# Altium schematic sheet lcd.SchDoc
size A4
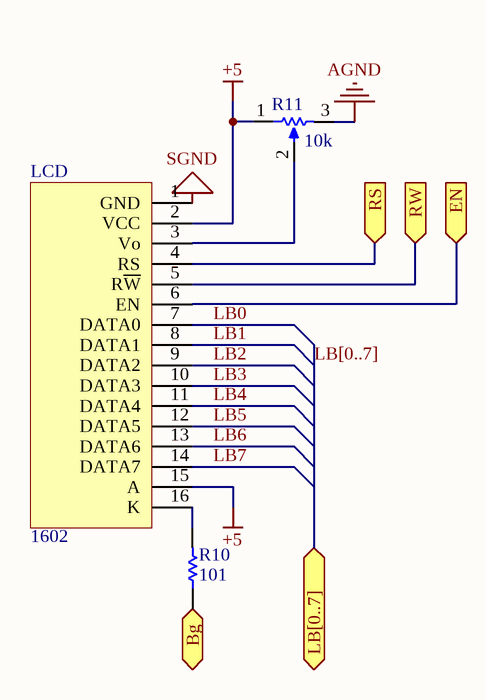
[diagram p0: lcd.SchDoc]

## Parts
LCD  1602  [1602(DIP)]
R10  value 101  [0805(M)]  (hidden comment: Res)
R11  value 10k  [3296W(DIP)]  (hidden comment: Rpot)

## Ports
Bg (in), EN (in), LB[0..7] (bidir), RS (in), RW (in)

## Nets
+5: LCD.2(VCC) LCD.15(A) R11.1(TOP)
AGND: R11.3(BOT)
SGND: LCD.1(GND)
Bg: R10.1 ; port Bg
EN: LCD.6(EN) ; port EN
LB0: LCD.7(DATA0)
LB1: LCD.8(DATA1)
LB2: LCD.9(DATA2)
LB3: LCD.10(DATA3)
LB4: LCD.11(DATA4)
LB5: LCD.12(DATA5)
LB6: LCD.13(DATA6)
LB7: LCD.14(DATA7)
RS: LCD.4(RS) ; port RS
RW: LCD.5(R~{W}) ; port RW
NetLCD_3: LCD.3(Vo) R11.2(TAP)
NetLCD_16: LCD.16(K) R10.2

## Buses and harness runs
bus LB[0..7] = port LB[0..7]

## Library data of the parts
LCD = 1602: lcd1602
R11 = Rpot: 电位计